# Altium project mini-et.PrjPCB
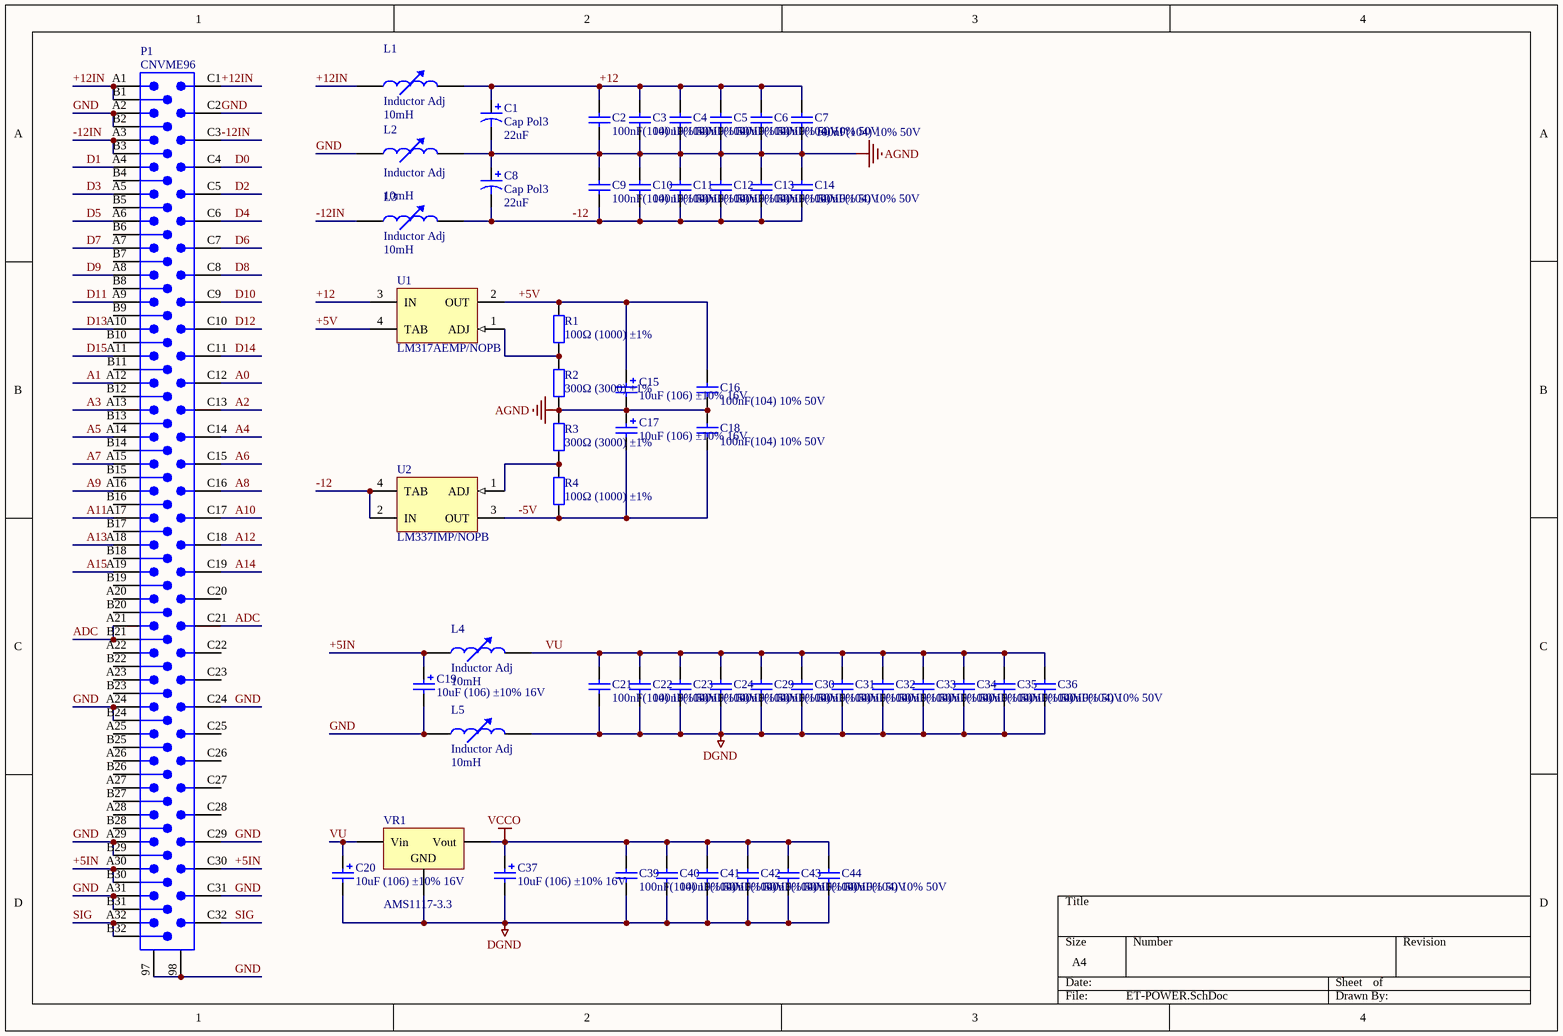
[diagram p0: ET-POWER.SchDoc]
4 sheets, 129 parts. Net scope: global (net labels, ports and power ports of the same name join across sheets).
Board file: mini-ET.PcbDoc
Sheets:
  ET-POWER.SchDoc
  ET-IO.SchDoc
  ET-AIO.SchDoc
  ET-DAC.SchDoc

## Sheet ET-POWER.SchDoc
size A4

### Parts
C1  Cap Pol3  value 22uF  [2220]
C2  100nF(104) 10% 50V  [LC-0805_C]
C3  100nF(104) 10% 50V  [LC-0805_C]
C4  100nF(104) 10% 50V  [LC-0805_C]
C5  100nF(104) 10% 50V  [LC-0805_C]
C6  100nF(104) 10% 50V  [LC-0805_C]
C7  100nF(104) 10% 50V  [LC-0805_C]
C8  Cap Pol3  value 22uF  [2220]
C9  100nF(104) 10% 50V  [LC-0805_C]
C10  100nF(104) 10% 50V  [LC-0805_C]
C11  100nF(104) 10% 50V  [LC-0805_C]
C12  100nF(104) 10% 50V  [LC-0805_C]
C13  100nF(104) 10% 50V  [LC-0805_C]
C14  100nF(104) 10% 50V  [LC-0805_C]
C15  10uF (106) ±10% 16V  [LC-CASE-A_3216]
C16  100nF(104) 10% 50V  [LC-0805_C]
C17  10uF (106) ±10% 16V  [LC-CASE-A_3216]
C18  100nF(104) 10% 50V  [LC-0805_C]
C19  10uF (106) ±10% 16V  [LC-CASE-A_3216]
C20  10uF (106) ±10% 16V  [LC-CASE-A_3216]
C21  100nF(104) 10% 50V  [LC-0805_C]
C22  100nF(104) 10% 50V  [LC-0805_C]
C23  100nF(104) 10% 50V  [LC-0805_C]
C24  100nF(104) 10% 50V  [LC-0805_C]
C29  100nF(104) 10% 50V  [LC-0805_C]
C30  100nF(104) 10% 50V  [LC-0805_C]
C31  100nF(104) 10% 50V  [LC-0805_C]
C32  100nF(104) 10% 50V  [LC-0805_C]
C33  100nF(104) 10% 50V  [LC-0805_C]
C34  100nF(104) 10% 50V  [LC-0805_C]
C35  100nF(104) 10% 50V  [LC-0805_C]
C36  100nF(104) 10% 50V  [LC-0805_C]
C37  10uF (106) ±10% 16V  [LC-CASE-A_3216]
C39  100nF(104) 10% 50V  [LC-0805_C]
C40  100nF(104) 10% 50V  [LC-0805_C]
C41  100nF(104) 10% 50V  [LC-0805_C]
C42  100nF(104) 10% 50V  [LC-0805_C]
C43  100nF(104) 10% 50V  [LC-0805_C]
C44  100nF(104) 10% 50V  [LC-0805_C]
L1  Inductor Adj  value 10mH  [AXIAL-0.4]
L2  Inductor Adj  value 10mH  [AXIAL-0.4]
L3  Inductor Adj  value 10mH  [AXIAL-0.4]
L4  Inductor Adj  value 10mH  [AXIAL-0.4]
L5  Inductor Adj  value 10mH  [AXIAL-0.4]
P1  CNVME96  [CNVME96]
R1  100Ω (1000) ±1%  [LC-0805_R]
R2  300Ω (3000) ±1%  [LC-0805_R]
R3  300Ω (3000) ±1%  [LC-0805_R]
R4  100Ω (1000) ±1%  [LC-0805_R]
U1  LM317AEMP/NOPB  [MP04A_N]
U2  LM337IMP/NOPB  [MP04A_N]
VR1  AMS1117-3.3  [LC-SOT-223]

### Nets
AGND: C1.2 C2.1 C3.1 C4.1 C5.1 C6.1 C7.1 C8.1 C9.2 C10.2 C11.2 C12.2 C13.2 C14.2 C15.2 C16.1 C17.1 C18.2 L2.2 R2.1 R3.2
DGND: C20.2 C21.1 C22.1 C23.1 C24.1 C29.1 C30.1 C31.1 C32.1 C33.1 C34.1 C35.1 C36.1 C37.2 C39.1 C40.1 C41.1 C42.1 C43.1 C44.1 L5.2 VR1.1(GND)
VCCO: C37.1 C39.2 C40.2 C41.2 C42.2 C43.2 C44.2 VR1.2(Vout)
VU: C20.1 C21.2 C22.2 C23.2 C24.2 C29.2 C30.2 C31.2 C32.2 C33.2 C34.2 C35.2 C36.2 L4.2 VR1.3(Vin)
+5IN: C19.1 L4.1 P1.A30 P1.B30 P1.C30
+5V: C15.1 C16.2 R1.2 U1.2(OUT) U1.4(TAB)
+12: C1.1 C2.2 C3.2 C4.2 C5.2 C6.2 C7.2 L1.2 U1.3(IN)
+12IN: L1.1 P1.A1 P1.B1 P1.C1
-5V: C17.2 C18.1 R4.1 U2.3(OUT)
-12: C8.2 C9.1 C10.1 C11.1 C12.1 C13.1 C14.1 L3.2 U2.2(IN) U2.4(TAB)
-12IN: L3.1 P1.A3 P1.B3 P1.C3
A0: P1.C12
A1: P1.A12
A2: P1.C13
A3: P1.A13
A4: P1.C14
A5: P1.A14
A6: P1.C15
A7: P1.A15
A8: P1.C16
A9: P1.A16
A10: P1.C17
A11: P1.A17
A12: P1.C18
A13: P1.A18
A14: P1.C19
A15: P1.A19
ADC: P1.A21 P1.B21 P1.C21
D0: P1.C4
D1: P1.A4
D2: P1.C5
D3: P1.A5
D4: P1.C6
D5: P1.A6
D6: P1.C7
D7: P1.A7
D8: P1.C8
D9: P1.A8
D10: P1.C9
D11: P1.A9
D12: P1.C10
D13: P1.A10
D14: P1.C11
D15: P1.A11
GND: C19.2 L2.1 L5.1 P1.97 P1.98 P1.A2 P1.A24 P1.A29 P1.A31 P1.B2 P1.B24 P1.B29 P1.B31 P1.C2 P1.C24 P1.C29 P1.C31
SIG: P1.A32 P1.B32 P1.C32
NetR1_1: R1.1 R2.2 U1.1(ADJ)
NetR3_1: R3.1 R4.2 U2.1(ADJ)

Not connected (* = marked no-connect by the designer): P1 A20 A22 A23 A25 A26 A27 A28 B4 B5 B6 B7 B8 B9 B10 B11 B12 B13 B14 B15 B16 B17 B18 B19 B20 B22 B23 B25 B26 B27 B28 C20 C22 C23 C25 C26 C27 C28

### Library data of the parts
C1 C8 = Cap Pol3: Polarized Capacitor (Surface Mount); Published: 8-Jun-2000; LatestRevisionDate: 29-May-2009; LatestRevisionNote: IPC-7351 Footprint Added.; PackageReference: C0805; Publisher: Altium Limited; PackageDescription: Chip Capacitor
C2-C7 C9-C14 C16 C18 C21-C24 C29-C36 C39-C44 = 0805 100nF(104) 10% 50V: 贴片电容; ComponentLink1Description: 供应商链接; ComponentLink1URL: http://www.szlcsc.com/product/details_50686.html; Package: 0805; Supplier: LC; SuppliersPartNumber: C49678
C15 C17 C19 C20 C37 = 3216 10uF (106) 10% 16V: 钽电容; ComponentLink1Description: 供应商链接; ComponentLink1URL: http://www.szlcsc.com/product/details_7643.html; Package: 3216; Supplier: LC; SuppliersPartNumber: C7171
L1-L5 = Inductor Adj: Adjustable Inductor; Set Position: 0.5; Published: 24-Mar-1999; LatestRevisionDate: 17-Jul-2002; LatestRevisionNote: Re-released for DXP Platform.; PackageReference: AXIAL-0.8; Publisher: Altium Limited; PackageDescription: Axial Device, Thru-Hole; 2 Leads; 0.8 in Pin Spacing
P1 = CNVME96: 96-Pin Connector (3x32 2.54mm grid); Text Field6: Alternate Layout Available; Text Field7: Published 14-Feb-2002
R1 R4 = 0805 100Ω (1000) 1%: 贴片电阻; ComponentLink1Description: 供应商链接; ComponentLink1URL: http://www.szlcsc.com/product/details_18096.html; Package: 0805; Supplier: LC; SuppliersPartNumber: C17408
R2 R3 = 0805 300Ω (3000) 1%: 贴片电阻; ComponentLink1Description: 供应商链接; ComponentLink1URL: http://www.szlcsc.com/product/details_18305.html; Package: 0805; Supplier: LC; SuppliersPartNumber: C17617
U1 = LM317AEMP/NOPB: 3-Terminal Adjustable Regulator, 4-pin SOT-223, Pb-Free; Manufacturer: National Semiconductor; PackageTopMarking: XYTT*N07A; PowerWise: N; CompType: LDO IC; High-Reliability: Y; DatasheetVersion: Apr-2007; PackageVersion: revB, Apr-2003; PackageReference: MP04A; PackageDescription: Molded SOT-223, 6.50 x 3.56 x 1.6mm Body, 4 Lead, 2.3mm Pitch; PartNumber: LM317AEMP/NOPB; RoHS: Y; PinCount: 4; Code_JEDEC: TO-261-AA; Code_IPC: SOT223-4; ComponentLink1Description: Manufacturer URL; ComponentLink1URL: http://www.national.com/; ComponentLink2Description: LM317 Datasheet; ComponentLink2URL: http://www.national.com/ds/LM/LM317.pdf; ComponentLink3Description: LM317 Web Page; ComponentLink3URL: http://www.national.com/pf/LM/LM317.html; ComponentLink4Description: MP04A Package Page; ComponentLink4URL: http://www.national.com/packaging/folders/mp04a.html
U2 = LM337IMP/NOPB: 3-Terminal Adjustable Negative Regulator, 4-pin SOT-223, Pb-Free; Manufacturer: National Semiconductor; PackageTopMarking: XYTT*N02A; PowerWise: N; CompType: LDO IC; Published: 1-Mar-2010; DatasheetVersion: Nov-2004; PackageVersion: revB, Apr-2003; PackageReference: MP04A; Publisher: Altium Limited; PackageDescription: Molded SOT-223, 6.50 x 3.56 x 1.6mm Body, 4 Lead, 2.3mm Pitch; Supplier 1: Digi-Key; Supplier Part Number 1: LM337IMPTR-ND; Supplier 2: Digi-Key; Supplier Part Number 2: LM337IMPCT-ND; Supplier 3: Digi-Key; Supplier Part Number 3: LM337IMPDKR-ND; Supplier 4: Newark; Supplier Part Number 4: 41K4742; PartNumber: LM337IMP/NOPB; RoHS: Y; PinCount: 4; Code_JEDEC: TO-261-AA; Code_IPC: SOT223-4; ComponentLink1Description: LM337 Datasheet; ComponentLink1URL: http://www.national.com/ds/LM/LM337.pdf; ComponentLink2Description: LM337 Web Page; ComponentLink2URL: http://www.national.com/pf/LM/LM337.html; ComponentLink3Description: MP04A Package Page; ComponentLink3URL: http://www.national.com/packaging/folders/mp04a.html
VR1 = SOT-223 AMS1117-3.3: 低压差线性稳压(LDO); ComponentLink1Description: 供应商链接; ComponentLink1URL: http://www.szlcsc.com/product/details_6652.html; Package: SOT-223; Supplier: LC; SuppliersPartNumber: C6186

## Sheet ET-IO.SchDoc
size A4
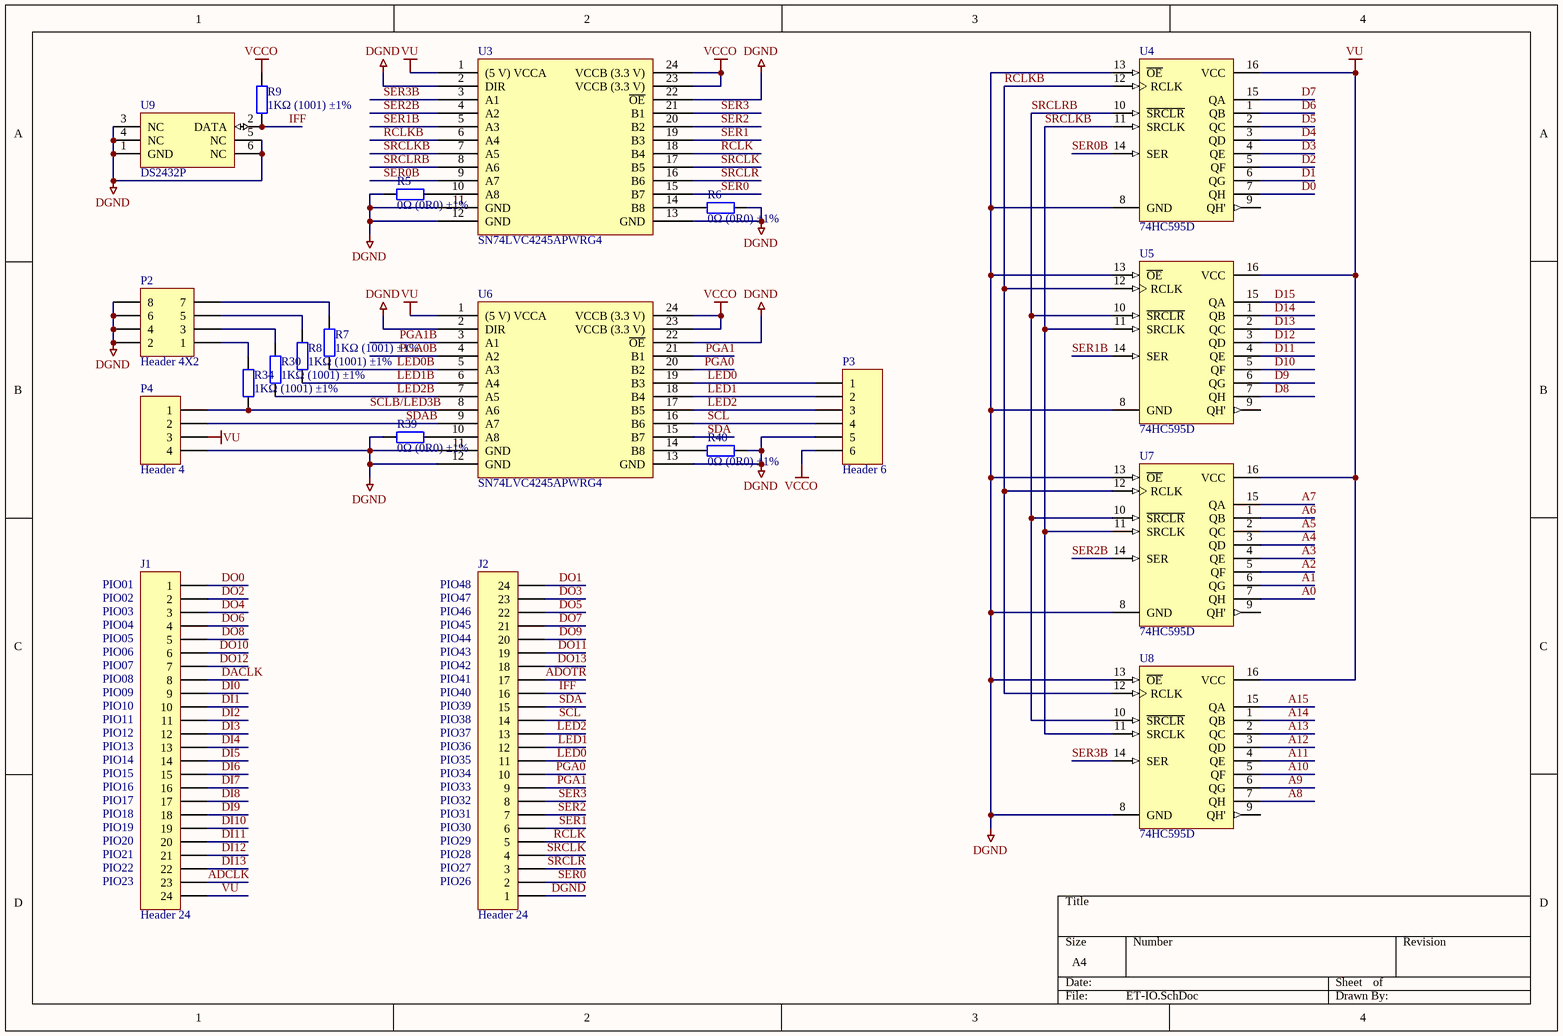
[diagram p1: ET-IO.SchDoc]

### Parts
J1  Header 24  [HDR1X24]
J2  Header 24  [HDR1X24]
P2  Header 4X2  [HDR2X4]
P3  Header 6  [HDR1X6]
P4  Header 4  [HDR1X4]
R5  0Ω (0R0) ±1%  [LC-0805_R]
R6  0Ω (0R0) ±1%  [LC-0805_R]
R7  1KΩ (1001) ±1%  [LC-0805_R]
R8  1KΩ (1001) ±1%  [LC-0805_R]
R9  1KΩ (1001) ±1%  [LC-0805_R]
R30  1KΩ (1001) ±1%  [LC-0805_R]
R34  1KΩ (1001) ±1%  [LC-0805_R]
R39  0Ω (0R0) ±1%  [LC-0805_R]
R40  0Ω (0R0) ±1%  [LC-0805_R]
U3  SN74LVC4245APWRG4  [LC-TSSOP-24]
U4  74HC595D  [LC-SOIC-16_150mil]
U5  74HC595D  [LC-SOIC-16_150mil]
U6  SN74LVC4245APWRG4  [LC-TSSOP-24]
U7  74HC595D  [LC-SOIC-16_150mil]
U8  74HC595D  [LC-SOIC-16_150mil]
U9  DS2432P  [TSOC6]

### Nets
DGND: J2.1 P2.2 P2.4 P2.6 P2.8 P3.5 P4.4 R5.1 R6.2 R39.1 R40.2 U3.2(DIR) U3.11(GND) U3.12(GND) U3.13(GND) U3.22(~{OE}) U4.8(GND) U4.13(~{OE}) U5.8(GND) U5.13(~{OE}) U6.2(DIR) U6.11(GND) U6.12(GND) U6.13(GND) U6.22(~{OE}) U7.8(GND) U7.13(~{OE}) U8.8(GND) U8.13(~{OE}) U9.1(GND) U9.3(NC) U9.4(NC) U9.5(NC) U9.6(NC)
VCCO: P3.6 R9.1 U3.23(VCCB_(3.3_V)) U3.24(VCCB_(3.3_V)) U6.23(VCCB_(3.3_V)) U6.24(VCCB_(3.3_V))
VU: J1.24 P4.3 U3.1((5_V)_VCCA) U4.16(VCC) U5.16(VCC) U6.1((5_V)_VCCA) U7.16(VCC) U8.16(VCC)
A0: U7.7(QH)
A1: U7.6(QG)
A2: U7.5(QF)
A3: U7.4(QE)
A4: U7.3(QD)
A5: U7.2(QC)
A6: U7.1(QB)
A7: U7.15(QA)
A8: U8.7(QH)
A9: U8.6(QG)
A10: U8.5(QF)
A11: U8.4(QE)
A12: U8.3(QD)
A13: U8.2(QC)
A14: U8.1(QB)
A15: U8.15(QA)
ADCLK: J1.23
ADOTR: J2.17
D0: U4.7(QH)
D1: U4.6(QG)
D2: U4.5(QF)
D3: U4.4(QE)
D4: U4.3(QD)
D5: U4.2(QC)
D6: U4.1(QB)
D7: U4.15(QA)
D8: U5.7(QH)
D9: U5.6(QG)
D10: U5.5(QF)
D11: U5.4(QE)
D12: U5.3(QD)
D13: U5.2(QC)
D14: U5.1(QB)
D15: U5.15(QA)
DACLK: J1.8
DI0: J1.9
DI1: J1.10
DI2: J1.11
DI3: J1.12
DI4: J1.13
DI5: J1.14
DI6: J1.15
DI7: J1.16
DI8: J1.17
DI9: J1.18
DI10: J1.19
DI11: J1.20
DI12: J1.21
DI13: J1.22
DO0: J1.1
DO1: J2.24
DO2: J1.2
DO3: J2.23
DO4: J1.3
DO5: J2.22
DO6: J1.4
DO7: J2.21
DO8: J1.5
DO9: J2.20
DO10: J1.6
DO11: J2.19
DO12: J1.7
DO13: J2.18
IFF: J2.16 R9.2 U9.2(DATA)
LED0: J2.11 P3.1 U6.19(B3)
LED0B: R7.2 U6.5(A3)
LED1: J2.12 P3.2 U6.18(B4)
LED1B: R8.2 U6.6(A4)
LED2: J2.13 P3.3 U6.17(B5)
LED2B: R30.1 U6.7(A5)
PGA0: J2.10 U6.20(B2)
PGA0B: U6.4(A2)
PGA1: J2.9 U6.21(B1)
PGA1B: U6.3(A1)
RCLK: J2.5 U3.18(B4)
RCLKB: U3.6(A4) U4.12(RCLK) U5.12(RCLK) U7.12(RCLK) U8.12(RCLK)
SCL: J2.14 P3.4 U6.16(B6)
SCLB/LED3B: P4.1 R34.2 U6.8(A6)
SDA: J2.15 U6.15(B7)
SDAB: P4.2 U6.9(A7)
SER0: J2.2 U3.15(B7)
SER0B: U3.9(A7) U4.14(SER)
SER1: J2.6 U3.19(B3)
SER1B: U3.5(A3) U5.14(SER)
SER2: J2.7 U3.20(B2)
SER2B: U3.4(A2) U7.14(SER)
SER3: J2.8 U3.21(B1)
SER3B: U3.3(A1) U8.14(SER)
SRCLK: J2.4 U3.17(B5)
SRCLKB: U3.7(A5) U4.11(SRCLK) U5.11(SRCLK) U7.11(SRCLK) U8.11(SRCLK)
SRCLR: J2.3 U3.16(B6)
SRCLRB: U3.8(A6) U4.10(~{SRCLR}) U5.10(~{SRCLR}) U7.10(~{SRCLR}) U8.10(~{SRCLR})
NetP2_1: P2.1 R34.1
NetP2_3: P2.3 R30.2
NetP2_5: P2.5 R8.1
NetP2_7: P2.7 R7.1
NetR5_2: R5.2 U3.10(A8)
NetR6_1: R6.1 U3.14(B8)
NetR39_2: R39.2 U6.10(A8)
NetR40_1: R40.1 U6.14(B8)

Not connected (* = marked no-connect by the designer): U4 9(QH'); U5 9(QH'); U7 9(QH'); U8 9(QH')

### Notes on the sheet
- (near J1) PIO01
- (near J1) PIO02
- (near J1) PIO03
- (near J1) PIO04
- (near J1) PIO05
- (near J1) PIO06
- (near J2) PIO48
- (near J2) PIO47
- (near J2) PIO46
- (near J2) PIO45
- (near J2) PIO44
- (near J2) PIO43
- (near J1) PIO07
- (near J1) PIO08
- (near J1) PIO09
- (near J1) PIO10
- (near J2) PIO42
- (near J2) PIO41
- (near J2) PIO40
- (near J2) PIO39
- (near J1) PIO11
- (near J1) PIO12
- (near J1) PIO13
- (near J1) PIO14
- (near J1) PIO15
- (near J1) PIO16
- (near J2) PIO38
- (near J2) PIO37
- (near J2) PIO36
- (near J2) PIO35
- (near J2) PIO34
- (near J2) PIO33
- (near J1) PIO17
- (near J1) PIO18
- (near J1) PIO19
- (near J1) PIO20
- (near J2) PIO32
- (near J2) PIO31
- (near J2) PIO30
- (near J2) PIO29
- (near J1) PIO21
- (near J1) PIO22
- (near J1) PIO23
- (near J2) PIO28
- (near J2) PIO27
- (near J2) PIO26

### Library data of the parts
J1 J2 = Header 24: Header, 24-Pin; LatestRevisionDate: 17-Jul-2002; LatestRevisionNote: Re-released for DXP Platform.; Publisher: Altium Limited
P2 = Header 4X2: Header, 4-Pin, Dual row; LatestRevisionDate: 17-Jul-2002; LatestRevisionNote: Re-released for DXP Platform.; Publisher: Altium Limited
P3 = Header 6: Header, 6-Pin; LatestRevisionDate: 17-Jul-2002; LatestRevisionNote: Re-released for DXP Platform.; Publisher: Altium Limited
P4 = Header 4: Header, 4-Pin; LatestRevisionDate: 17-Jul-2002; LatestRevisionNote: Re-released for DXP Platform.; Publisher: Altium Limited
R5 R6 R39 R40 = 0805 0Ω (0R0) 1%: 贴片电阻; ComponentLink1Description: 供应商链接; ComponentLink1URL: http://www.szlcsc.com/product/details_18165.html; Package: 0805; Supplier: LC; SuppliersPartNumber: C17477
R7-R9 R30 R34 = 0805 1KΩ (1001) 1%: 贴片电阻; ComponentLink1Description: 供应商链接; ComponentLink1URL: http://www.szlcsc.com/product/details_18201.html; Package: 0805; Supplier: LC; SuppliersPartNumber: C17513
U3 U6 = SN74LVC4245APWRG4: 74系列逻辑芯片; ComponentLink1Description: 供应商链接; ComponentLink1URL: http://www.szlcsc.com/product/details_8336.html; Package: TSSOP-24; Supplier: LC; SuppliersPartNumber: C7859
U4 U5 U7 U8 = 74HC595D: 74系列逻辑芯片; ComponentLink1Description: 供应商链接; ComponentLink1URL: http://www.szlcsc.com/product/details_6413.html; Package: SOIC-16_150mil; Supplier: LC; SuppliersPartNumber: C5947
U9 = DS2430AP: 256-Bit 1-Wire EEPROM; Note: Pin numbers 3-6 are Not Connected (NC); Published: 13-Oct-2000; LatestRevisionDate: 17-Jul-2002; LatestRevisionNote: Re-released for DXP Platform.; DatasheetVersion: 21-Oct-1999; PackageVersion: 1999; PackageReference: TSOC6; Publisher: Altium Limited; PackageDescription: Small Outline; 6 C-Bend Leads; Body Width 3.8 mm; Pitch 1.27 mm; ComponentLink1Description: Manufacturer Link; ComponentLink1URL: http://www.maxim-ic.com/; ComponentLink2Description: Datasheet; ComponentLink2URL: http://pdfserv.maxim-ic.com/en/ds/DS2430A.pdf

## Sheet ET-AIO.SchDoc: Eurocard VME 3U (3.937 x 6.299 inches)
size A4; Organization: Organization; Address1: Address1; Address2: Address2; Address3: Address3; Address4: Address4; DocumentNumber: 1; Revision: 0; SheetNumber: 2; SheetTotal: 2
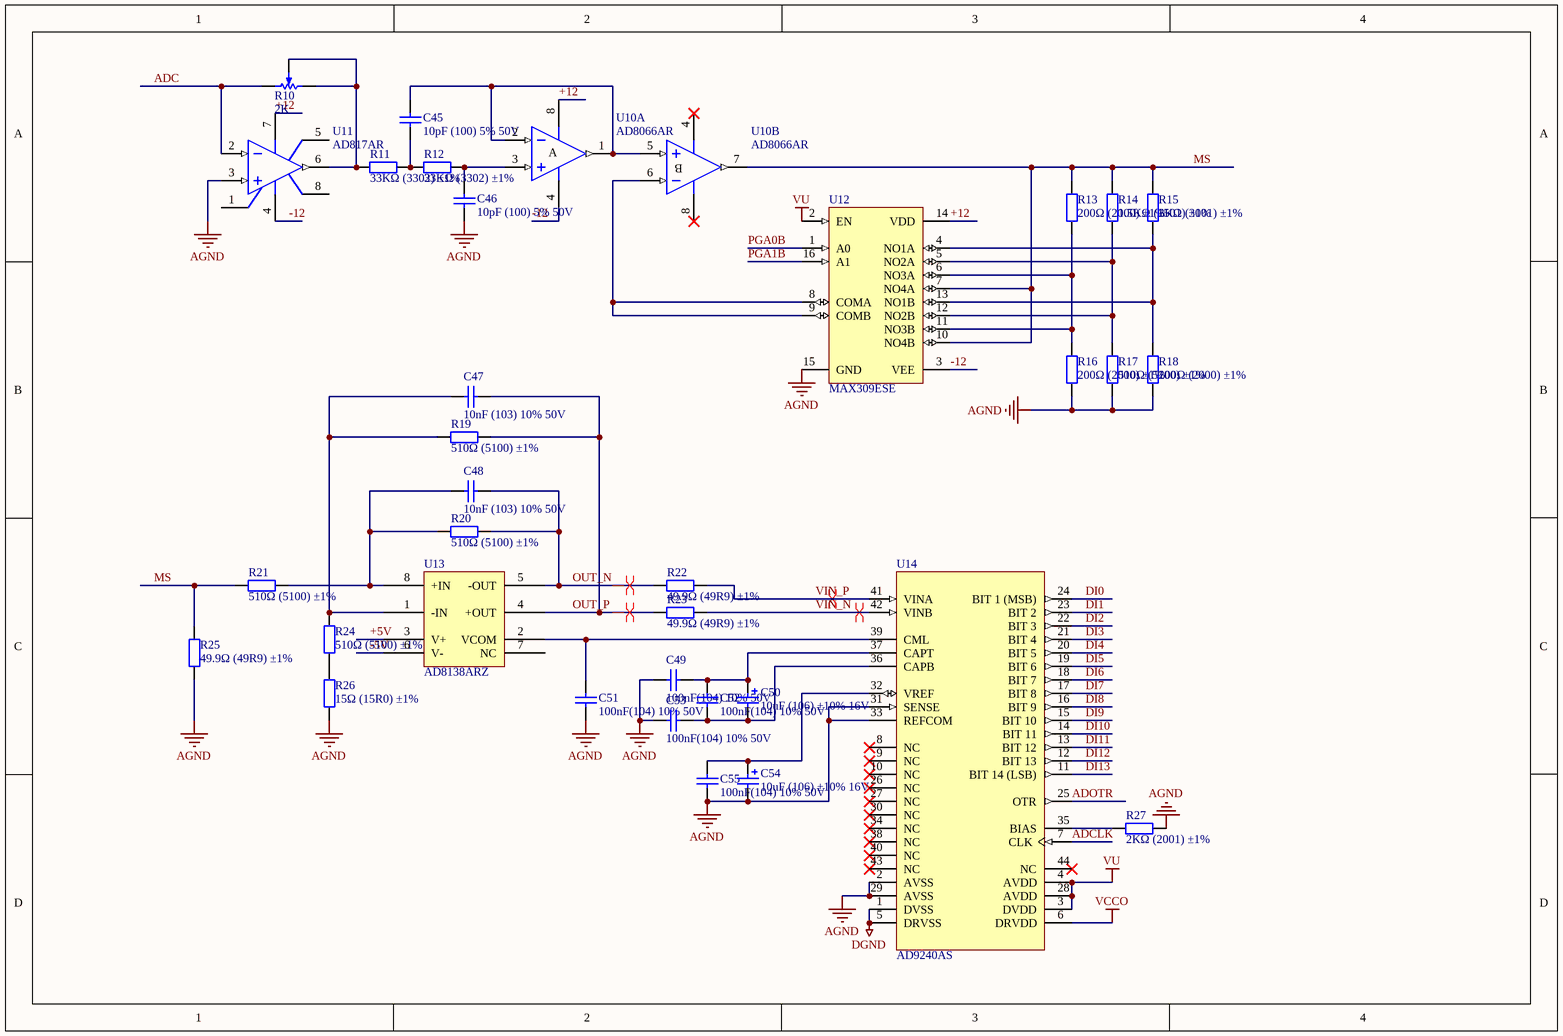
[diagram p2: ET-AIO.SchDoc]

### Parts
C45  10pF (100) 5% 50V  [LC-0805_C]
C46  10pF (100) 5% 50V  [LC-0805_C]
C47  10nF (103) 10% 50V  [LC-0805_C]
C48  10nF (103) 10% 50V  [LC-0805_C]
C49  100nF(104) 10% 50V  [LC-0805_C]
C50  10uF (106) ±10% 16V  [LC-CASE-A_3216]
C51  100nF(104) 10% 50V  [LC-0805_C]
C52  100nF(104) 10% 50V  [LC-0805_C]
C53  100nF(104) 10% 50V  [LC-0805_C]
C54  10uF (106) ±10% 16V  [LC-CASE-A_3216]
C55  100nF(104) 10% 50V  [LC-0805_C]
R10  2K  [POT4MM-2]
R11  33KΩ (3302) ±1%  [LC-0805_R]
R12  33KΩ (3302) ±1%  [LC-0805_R]
R13  200Ω (2000) ±1%  [LC-0805_R]
R14  1.5KΩ (1501) ±1%  [LC-0805_R]
R15  3KΩ (3001) ±1%  [LC-0805_R]
R16  200Ω (2000) ±1%  [LC-0805_R]
R17  510Ω (5100) ±1%  [LC-0805_R]
R18  200Ω (2000) ±1%  [LC-0805_R]
R19  510Ω (5100) ±1%  [LC-0805_R]
R20  510Ω (5100) ±1%  [LC-0805_R]
R21  510Ω (5100) ±1%  [LC-0805_R]
R22  49.9Ω (49R9) ±1%  [LC-0805_R]
R23  49.9Ω (49R9) ±1%  [LC-0805_R]
R24  510Ω (5100) ±1%  [LC-0805_R]
R25  49.9Ω (49R9) ±1%  [LC-0805_R]
R26  15Ω (15R0) ±1%  [LC-0805_R]
R27  2KΩ (2001) ±1%  [LC-0805_R]
U10  AD8066AR  [SO-8_N]  (parts A,B of 2)
U11  AD817AR  [SO-8_N]
U12  MAX309ESE  [NSO16_N]
U13  AD8138ARZ  [SO-8_N]
U14  AD9240AS  [S-44-MQFP_N]

### Nets
AGND: C46.1 C49.2 C51.1 C53.2 C54.2 C55.1 R16.1 R17.1 R18.1 R25.1 R26.1 R27.2 U11.3(IN+) U12.15(GND) U14.2(AVSS) U14.29(AVSS) U14.31(SENSE) U14.33(REFCOM)
DGND: U14.1(DVSS) U14.5(DRVSS)
VCCO: U14.6(DRVDD)
VU: U12.2(EN) U14.3(DVDD) U14.4(AVDD) U14.28(AVDD)
+5V: U13.3(V+)
+12: U10.8(V+) U11.7(V+) U12.14(VDD)
-5V: U13.6(V-)
-12: U10.4(V-) U11.4(V-) U12.3(VEE)
ADC: R10.CW(+) U11.2(IN-)
ADCLK: U14.7(CLK)
ADOTR: U14.25(OTR)
DI0: U14.24(BIT_1_(MSB))
DI1: U14.23(BIT_2)
DI2: U14.22(BIT_3)
DI3: U14.21(BIT_4)
DI4: U14.20(BIT_5)
DI5: U14.19(BIT_6)
DI6: U14.18(BIT_7)
DI7: U14.17(BIT_8)
DI8: U14.16(BIT_9)
DI9: U14.15(BIT_10)
DI10: U14.14(BIT_11)
DI11: U14.13(BIT_12)
DI12: U14.12(BIT_13)
DI13: U14.11(BIT_14_(LSB))
MS: R13.2 R14.2 R15.2 R21.1 R25.2 U10.7(OUT) U12.7(NO4A) U12.10(NO4B)
OUT_N: C48.2 R20.2 R22.1 U13.5(-OUT)
OUT_P: C47.2 R19.2 R23.1 U13.4(+OUT)
PGA0B: U12.1(A0)
PGA1B: U12.16(A1)
VIN_N: R23.2 U14.42(VINB)
VIN_P: R22.2 U14.41(VINA)
NetC45_1: C45.1 R11.2 R12.1
NetC45_2: C45.2 U10.1(OUT) U10.2(IN-) U10.5(IN+)
NetC46_2: C46.2 R12.2 U10.3(IN+)
NetC47_1: C47.1 R19.1 R24.2 U13.1(-IN)
NetC48_1: C48.1 R20.1 R21.2 U13.8(+IN)
NetC49_1: C49.1 C50.1 C52.2 U14.37(CAPT)
NetC50_2: C50.2 C52.1 C53.1 U14.36(CAPB)
NetC51_2: C51.2 U13.2(VCOM) U14.39(CML)
NetC54_1: C54.1 C55.2 U14.32(VREF)
NetR10_CCW: R10.CCW(-) R10.W R11.1 U11.6(OUT)
NetR13_1: R13.1 R16.2 U12.6(NO3A) U12.11(NO3B)
NetR14_1: R14.1 R17.2 U12.5(NO2A) U12.12(NO2B)
NetR15_1: R15.1 R18.2 U12.4(NO1A) U12.13(NO1B)
NetR24_1: R24.1 R26.2
NetR27_1: R27.1 U14.35(BIAS)
NetU10_6: U10.6(IN-) U12.8(COMA) U12.9(COMB)

Not connected (* = marked no-connect by the designer): U11 1(NULL1) 5(NC) 8(NULL2); U13 7(NC); U14 8(NC)* 9(NC)* 10(NC)* 26(NC)* 27(NC)* 30(NC)* 34(NC)* 38(NC)* 40(NC)* 43(NC)* 44(NC)*

### Layout directives
differential pair: OUT_N, OUT_P, VIN_N, VIN_P

### Notes on the sheet
- (in symbol AD8056AR, part A) A
- (in symbol AD8056AR, part B) B

### Library data of the parts
C45 C46 = 0805 10pF (100) 5% 50V: 贴片电容; ComponentLink1Description: 供应商链接; ComponentLink1URL: http://www.szlcsc.com/product/details_2137.html; Package: 0805; Supplier: LC; SuppliersPartNumber: C1785
C47 C48 = 0805 10nF (103) 10% 50V: 贴片电容; ComponentLink1Description: 供应商链接; ComponentLink1URL: http://www.szlcsc.com/product/details_2062.html; Package: 0805; Supplier: LC; SuppliersPartNumber: C1710
C49 C51-C53 C55 = 0805 100nF(104) 10% 50V: 贴片电容; ComponentLink1Description: 供应商链接; ComponentLink1URL: http://www.szlcsc.com/product/details_50686.html; Package: 0805; Supplier: LC; SuppliersPartNumber: C49678
C50 C54 = 3216 10uF (106) 10% 16V: 钽电容; ComponentLink1Description: 供应商链接; ComponentLink1URL: http://www.szlcsc.com/product/details_7643.html; Package: 3216; Supplier: LC; SuppliersPartNumber: C7171
R10 = RPot SM: Square Trimming Potentiometer; Published: 17-Dec-2003; DatasheetVersion: Oct-2003; PackageReference: POT4MM-2; Publisher: Altium Limited; PackageDescription: Square Trimming Potentiometer; ComponentLink1Description: Manufacturer Link; ComponentLink1URL: http://bourns.com/2/search.html
R11 R12 = 0805 33KΩ (3302) 1%: 贴片电阻; ComponentLink1Description: 供应商链接; ComponentLink1URL: http://www.szlcsc.com/product/details_18321.html; Package: 0805; Supplier: LC; SuppliersPartNumber: C17633
R13 R16 R18 = 0805 200Ω (2000) 1%: 贴片电阻; ComponentLink1Description: 供应商链接; ComponentLink1URL: http://www.szlcsc.com/product/details_18228.html; Package: 0805; Supplier: LC; SuppliersPartNumber: C17540
R14 = 0805 1.5KΩ (1501) 1%: 贴片电阻; ComponentLink1Description: 供应商链接; ComponentLink1URL: http://www.szlcsc.com/product/details_4717.html; Package: 0805; Supplier: LC; SuppliersPartNumber: C4310
R15 = 0805 3KΩ (3001) 1%: 贴片电阻; ComponentLink1Description: 供应商链接; ComponentLink1URL: http://www.szlcsc.com/product/details_18349.html; Package: 0805; Supplier: LC; SuppliersPartNumber: C17661
R17 R19-R21 R24 = 0805 510Ω (5100) 1%: 贴片电阻; ComponentLink1Description: 供应商链接; ComponentLink1URL: http://www.szlcsc.com/product/details_18422.html; Package: 0805; Supplier: LC; SuppliersPartNumber: C17734
R22 R23 R25 = 0805 49.9Ω (49R9) 1%: 贴片电阻; ComponentLink1Description: 供应商链接; ComponentLink1URL: http://www.szlcsc.com/product/details_18408.html; Package: 0805; Supplier: LC; SuppliersPartNumber: C17720
R26 = 0805 15Ω (15R0) 1%: 贴片电阻; ComponentLink1Description: 供应商链接; ComponentLink1URL: http://www.szlcsc.com/product/details_18168.html; Package: 0805; Supplier: LC; SuppliersPartNumber: C17480
R27 = 0805 2KΩ (2001) 1%: 贴片电阻; ComponentLink1Description: 供应商链接; ComponentLink1URL: http://www.szlcsc.com/product/details_18292.html; Package: 0805; Supplier: LC; SuppliersPartNumber: C17604
U10 = AD8056AR: Low Cost, 300MHz Voltage Feedback Amplifier; Published: 8-Jun-2000; LatestRevisionDate: 13-Apr-2006; LatestRevisionNote: IPC-7351 Footprint Added.; DatasheetVersion: REV. 0 1997; PackageVersion: revA; PackageReference: SO-8; Publisher: Altium Limited; PackageDescription: 8-Pin Small Outline Integrated Circuit 1.27 mm Pitch; Code_JEDEC: MS-012-AA; Code_IPC: SOIC127P600-8; ComponentLink1Description: Manufacturer Link; ComponentLink1URL: http://www.analog.com/en/prod/0,,759_786_AD8055%2C00.html; ComponentLink2Description: Datasheet; ComponentLink2URL: http://www.analog.com/UploadedFiles/Data_Sheets/40402558757264AD8055_6_i.pdf
U11 = AD817AR: High-Speed, Low-Power Wide Supply Range Amplifier; Note: Pin 5 is not connected.; Published: 8-Jun-2000; LatestRevisionDate: 13-Apr-2006; LatestRevisionNote: IPC-7351 Footprint Added.; DatasheetVersion: REV. B 1995; PackageVersion: revA; PackageReference: SO-8; Publisher: Altium Limited; PackageDescription: 8-Pin Small Outline Integrated Circuit 1.27 mm Pitch; Code_JEDEC: MS-012-AA; Code_IPC: SOIC127P600-8; ComponentLink1Description: Manufacturer Link; ComponentLink1URL: http://www.analog.com/en/prod/0,,759_786_AD817%2C00.html; ComponentLink2Description: Datasheet; ComponentLink2URL: http://www.analog.com/UploadedFiles/Data_Sheets/289066266ad817.pdf
U12 = MAX309ESE: Precision, Dual 4-Channel, High-Performance, CMOS Analog Multiplexer; Published: 16-Jan-2001; LatestRevisionDate: 13-Apr-2006; LatestRevisionNote: IPC-7351 Footprint Added.; DatasheetVersion: Jul-1994; PackageReference: NSO16; Publisher: Altium Limited; PackageDescription: 16-Pin Small Outline Integrated Circuit 1.27 mm Pitch; Code_JEDEC: MS-012-AC; Code_IPC: SOIC127P600-16; ComponentLink1Description: Manufacturer Link; ComponentLink1URL: http://www.maxim-ic.com/; ComponentLink2Description: Datasheet; ComponentLink2URL: http://pdfserv.maxim-ic.com/en/ds/MAX308-MAX309.pdf
U14 = AD9240AS: Complete 14-Bit, 10 MSPS Monolithic A/D Converter, 44-Pin MQFP, Industrial; Published: 26-May-2004; LatestRevisionDate: 13-Apr-2006; LatestRevisionNote: IPC-7351 Footprint Added.; DatasheetVersion: Rev. A; PackageVersion: Rev. A; PackageReference: S-44-MQFP; Publisher: Altium Limited; PackageDescription: 44-Pin Metric Quad Flat Pack 0.8 mm Pitch; Code_IPC: QFP80P1320X1320-44; ComponentLink1Description: Manufacturer Link; ComponentLink1URL: http://www.analog.com/en/prod/0%2C2877%2CAD9240%2C00.html; ComponentLink2Description: Datasheet; ComponentLink2URL: http://www.analog.com/UploadedFiles/Data_Sheets/417954540AD9240_a.pdf

## Sheet ET-DAC.SchDoc
size A4
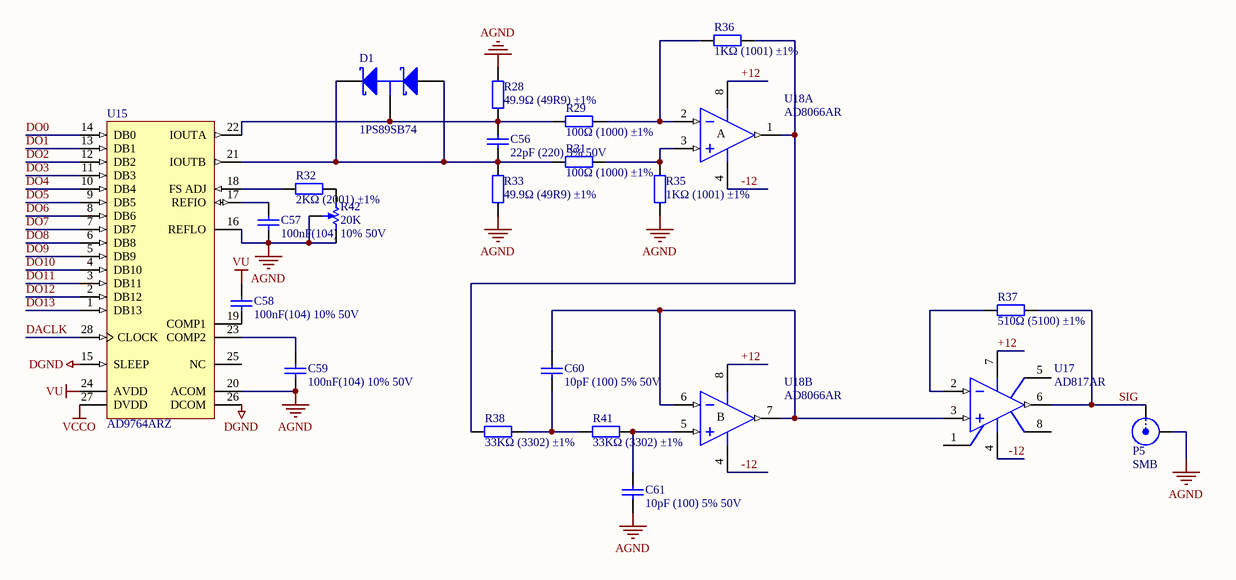
[diagram p3: ET-DAC.SchDoc]

### Parts
C56  22pF (220) 5% 50V  [LC-0805_C]
C57  100nF(104) 10% 50V  [LC-0805_C]
C58  100nF(104) 10% 50V  [LC-0805_C]
C59  100nF(104) 10% 50V  [LC-0805_C]
C60  10pF (100) 5% 50V  [LC-0805_C]
C61  10pF (100) 5% 50V  [LC-0805_C]
D1  1PS89SB74  [SOT23_M]
P5  SMB  [SMB_V-RJ45]
R28  49.9Ω (49R9) ±1%  [LC-0805_R]
R29  100Ω (1000) ±1%  [LC-0805_R]
R31  100Ω (1000) ±1%  [LC-0805_R]
R32  2KΩ (2001) ±1%  [LC-0805_R]
R33  49.9Ω (49R9) ±1%  [LC-0805_R]
R35  1KΩ (1001) ±1%  [LC-0805_R]
R36  1KΩ (1001) ±1%  [LC-0805_R]
R37  510Ω (5100) ±1%  [LC-0805_R]
R38  33KΩ (3302) ±1%  [LC-0805_R]
R41  33KΩ (3302) ±1%  [LC-0805_R]
R42  20K  [POT4MM-2]
U15  AD9764ARZ  [RW-28_N]
U17  AD817AR  [SO-8_N]
U18  AD8066AR  [SO-8_N]  (parts A,B of 2)

### Nets
AGND: C57.1 C59.1 C61.1 P5.2(Y) R28.2 R33.1 R35.2 R42.CW(+) R42.W U15.16(REFLO) U15.20(ACOM)
DGND: U15.15(SLEEP) U15.26(DCOM)
VCCO: U15.27(DVDD)
VU: C58.2 U15.24(AVDD)
+12: U17.7(V+) U18.8(V+)
-12: U17.4(V-) U18.4(V-)
DACLK: U15.28(CLOCK)
DO0: U15.14(DB0)
DO1: U15.13(DB1)
DO2: U15.12(DB2)
DO3: U15.11(DB3)
DO4: U15.10(DB4)
DO5: U15.9(DB5)
DO6: U15.8(DB6)
DO7: U15.7(DB7)
DO8: U15.6(DB8)
DO9: U15.5(DB9)
DO10: U15.4(DB10)
DO11: U15.3(DB11)
DO12: U15.2(DB12)
DO13: U15.1(DB13)
SIG: P5.1(X) R37.2 U17.6(OUT)
NetC56_1: C56.1 D1.1(A) D1.2(K) R31.1 R33.2 U15.21(IOUTB)
NetC56_2: C56.2 D1.3(C) R28.1 R29.1 U15.22(IOUTA)
NetC57_2: C57.2 U15.17(REFIO)
NetC58_1: C58.1 U15.19(COMP1)
NetC59_2: C59.2 U15.23(COMP2)
NetC60_1: C60.1 R38.2 R41.1
NetC60_2: C60.2 U17.3(IN+) U18.6(IN-) U18.7(OUT)
NetC61_2: C61.2 R41.2 U18.5(IN+)
NetR29_2: R29.2 R36.2 U18.2(IN-)
NetR31_2: R31.2 R35.1 U18.3(IN+)
NetR32_1: R32.1 R42.CCW(-)
NetR32_2: R32.2 U15.18(FS_ADJ)
NetR36_1: R36.1 R38.1 U18.1(OUT)
NetR37_1: R37.1 U17.2(IN-)

Not connected (* = marked no-connect by the designer): U15 25(NC); U17 1(NULL1) 5(NC) 8(NULL2)

### Notes on the sheet
- (in symbol AD8056AR, part A) A
- (in symbol AD8056AR, part B) B

### Library data of the parts
C56 = 0805 22pF (220) 5% 50V: 贴片电容; ComponentLink1Description: 供应商链接; ComponentLink1URL: http://www.szlcsc.com/product/details_2156.html; Package: 0805; Supplier: LC; SuppliersPartNumber: C1804
C57-C59 = 0805 100nF(104) 10% 50V: 贴片电容; ComponentLink1Description: 供应商链接; ComponentLink1URL: http://www.szlcsc.com/product/details_50686.html; Package: 0805; Supplier: LC; SuppliersPartNumber: C49678
C60 C61 = 0805 10pF (100) 5% 50V: 贴片电容; ComponentLink1Description: 供应商链接; ComponentLink1URL: http://www.szlcsc.com/product/details_2137.html; Package: 0805; Supplier: LC; SuppliersPartNumber: C1785
D1 = 1PS89SB74: Schottky Barrier Double Diode; Published: 17-Sep-2003; DatasheetVersion: 20-Apr-2001; PackageVersion: Oct-1998; PackageReference: SOT490; Publisher: Altium Limited; PackageDescription: SC-89; 3 Flat Leads; Body 1.6 x 1.6 x 0.7 mm, inc leads (LxWxH typ); ComponentLink1Description: Manufacturer Link; ComponentLink1URL: http://www.semiconductors.philips.com/; ComponentLink2Description: Datasheet; ComponentLink2URL: http://www.semiconductors.philips.com/acrobat/datasheets/1PS89SB74_1.pdf
P5 = SMB: SMB Straight Connector; LatestRevisionDate: 17-Jul-2002; LatestRevisionNote: Re-released for DXP Platform.; Publisher: Altium Limited
R28 R33 = 0805 49.9Ω (49R9) 1%: 贴片电阻; ComponentLink1Description: 供应商链接; ComponentLink1URL: http://www.szlcsc.com/product/details_18408.html; Package: 0805; Supplier: LC; SuppliersPartNumber: C17720
R29 R31 = 0805 100Ω (1000) 1%: 贴片电阻; ComponentLink1Description: 供应商链接; ComponentLink1URL: http://www.szlcsc.com/product/details_18096.html; Package: 0805; Supplier: LC; SuppliersPartNumber: C17408
R32 = 0805 2KΩ (2001) 1%: 贴片电阻; ComponentLink1Description: 供应商链接; ComponentLink1URL: http://www.szlcsc.com/product/details_18292.html; Package: 0805; Supplier: LC; SuppliersPartNumber: C17604
R35 R36 = 0805 1KΩ (1001) 1%: 贴片电阻; ComponentLink1Description: 供应商链接; ComponentLink1URL: http://www.szlcsc.com/product/details_18201.html; Package: 0805; Supplier: LC; SuppliersPartNumber: C17513
R37 = 0805 510Ω (5100) 1%: 贴片电阻; ComponentLink1Description: 供应商链接; ComponentLink1URL: http://www.szlcsc.com/product/details_18422.html; Package: 0805; Supplier: LC; SuppliersPartNumber: C17734
R38 R41 = 0805 33KΩ (3302) 1%: 贴片电阻; ComponentLink1Description: 供应商链接; ComponentLink1URL: http://www.szlcsc.com/product/details_18321.html; Package: 0805; Supplier: LC; SuppliersPartNumber: C17633
R42 = RPot SM: Square Trimming Potentiometer; Published: 17-Dec-2003; DatasheetVersion: Oct-2003; PackageReference: POT4MM-2; Publisher: Altium Limited; PackageDescription: Square Trimming Potentiometer; ComponentLink1Description: Manufacturer Link; ComponentLink1URL: http://bourns.com/2/search.html
U15 = AD9764ARZ: Single 14-Bit TxDAC, 125 Msps, -40 to +85 degC, RW-28, Pb-Free, Tube; Generic Part Number: AD9764; Manufacturer: Analog Devices; # DAC Outputs: 1; Max V+: 5.5V; Op Pwr Diss: 170mW; Resolution (Bits): 14; Settling Time: 35ns; Single Supply: Yes; DatasheetVersion: Rev.B; PackageVersion: 060706-A; PackageReference: RW-28; PackageDescription: 28-Lead Standard Small Outline Package [SOIC_W]; Supplier 1: Digi-Key; Supplier Part Number 1: AD9764ARZ-ND; Supplier 2: Farnell; Supplier Part Number 2: 9425640; Supplier 3: Newark; Supplier Part Number 3: 59K7408; Supplier 4: Mouser; Supplier Part Number 4: 584-AD9764ARZ; Packing: Tube; RoHS: Y; Mounting Technology: Surface Mount; Code_JEDEC: MS-013-AE; PartNumber: AD9764ARZ; ComponentLink1Description: Manufacturer URL; ComponentLink1URL: http://www.analog.com/en/index.html; ComponentLink2Description: Datasheet; ComponentLink2URL: http://www.analog.com/static/imported-files/data_sheets/AD9764.pdf; ComponentLink3Description: Product URL; ComponentLink3URL: http://www.analog.com/en/digital-to-analog-converters/da-converters/ad9764/products/product.html
U17 = AD817AR: as U11 on sheet ET-AIO; Published: 8-Jun-2000; LatestRevisionDate: 13-Apr-2006; LatestRevisionNote: IPC-7351 Footprint Added.; DatasheetVersion: REV. B 1995; PackageVersion: revA; PackageReference: SO-8; Publisher: Altium Limited; PackageDescription: 8-Pin Small Outline Integrated Circuit 1.27 mm Pitch; Code_JEDEC: MS-012-AA; Code_IPC: SOIC127P600-8; ComponentLink1Description: Manufacturer Link; ComponentLink1URL: http://www.analog.com/en/prod/0,,759_786_AD817%2C00.html; ComponentLink2Description: Datasheet; ComponentLink2URL: http://www.analog.com/UploadedFiles/Data_Sheets/289066266ad817.pdf
U18 = AD8056AR: as U10 on sheet ET-AIO; Published: 8-Jun-2000; LatestRevisionDate: 13-Apr-2006; LatestRevisionNote: IPC-7351 Footprint Added.; DatasheetVersion: REV. 0 1997; PackageVersion: revA; PackageReference: SO-8; Publisher: Altium Limited; PackageDescription: 8-Pin Small Outline Integrated Circuit 1.27 mm Pitch; Code_JEDEC: MS-012-AA; Code_IPC: SOIC127P600-8; ComponentLink1Description: Manufacturer Link; ComponentLink1URL: http://www.analog.com/en/prod/0,,759_786_AD8055%2C00.html; ComponentLink2Description: Datasheet; ComponentLink2URL: http://www.analog.com/UploadedFiles/Data_Sheets/40402558757264AD8055_6_i.pdf

## Nets that join several sheets
AGND: ET-POWER (21 pins), ET-AIO (18 pins), ET-DAC (11 pins)
DGND: ET-POWER (22 pins), ET-IO (34 pins), ET-AIO (U14.1 U14.5), ET-DAC (U15.15 U15.26)
VCCO: ET-POWER (8 pins), ET-IO (6 pins), ET-AIO (U14.6), ET-DAC (U15.27)
VU: ET-POWER (15 pins), ET-IO (8 pins), ET-AIO (U12.2 U14.3 U14.4 U14.28), ET-DAC (C58.2 U15.24)
+5V: ET-POWER (5 pins), ET-AIO (U13.3)
+12: ET-POWER (9 pins), ET-AIO (U10.8 U11.7 U12.14), ET-DAC (U17.7 U18.8)
-5V: ET-POWER (C17.2 C18.1 R4.1 U2.3), ET-AIO (U13.6)
-12: ET-POWER (10 pins), ET-AIO (U10.4 U11.4 U12.3), ET-DAC (U17.4 U18.4)
A0: ET-POWER (P1.C12), ET-IO (U7.7)
A1: ET-POWER (P1.A12), ET-IO (U7.6)
A2: ET-POWER (P1.C13), ET-IO (U7.5)
A3: ET-POWER (P1.A13), ET-IO (U7.4)
A4: ET-POWER (P1.C14), ET-IO (U7.3)
A5: ET-POWER (P1.A14), ET-IO (U7.2)
A6: ET-POWER (P1.C15), ET-IO (U7.1)
A7: ET-POWER (P1.A15), ET-IO (U7.15)
A8: ET-POWER (P1.C16), ET-IO (U8.7)
A9: ET-POWER (P1.A16), ET-IO (U8.6)
A10: ET-POWER (P1.C17), ET-IO (U8.5)
A11: ET-POWER (P1.A17), ET-IO (U8.4)
A12: ET-POWER (P1.C18), ET-IO (U8.3)
A13: ET-POWER (P1.A18), ET-IO (U8.2)
A14: ET-POWER (P1.C19), ET-IO (U8.1)
A15: ET-POWER (P1.A19), ET-IO (U8.15)
ADC: ET-POWER (P1.A21 P1.B21 P1.C21), ET-AIO (R10.CW U11.2)
ADCLK: ET-IO (J1.23), ET-AIO (U14.7)
ADOTR: ET-IO (J2.17), ET-AIO (U14.25)
D0: ET-POWER (P1.C4), ET-IO (U4.7)
D1: ET-POWER (P1.A4), ET-IO (U4.6)
D2: ET-POWER (P1.C5), ET-IO (U4.5)
D3: ET-POWER (P1.A5), ET-IO (U4.4)
D4: ET-POWER (P1.C6), ET-IO (U4.3)
D5: ET-POWER (P1.A6), ET-IO (U4.2)
D6: ET-POWER (P1.C7), ET-IO (U4.1)
D7: ET-POWER (P1.A7), ET-IO (U4.15)
D8: ET-POWER (P1.C8), ET-IO (U5.7)
D9: ET-POWER (P1.A8), ET-IO (U5.6)
D10: ET-POWER (P1.C9), ET-IO (U5.5)
D11: ET-POWER (P1.A9), ET-IO (U5.4)
D12: ET-POWER (P1.C10), ET-IO (U5.3)
D13: ET-POWER (P1.A10), ET-IO (U5.2)
D14: ET-POWER (P1.C11), ET-IO (U5.1)
D15: ET-POWER (P1.A11), ET-IO (U5.15)
DACLK: ET-IO (J1.8), ET-DAC (U15.28)
DI0: ET-IO (J1.9), ET-AIO (U14.24)
DI1: ET-IO (J1.10), ET-AIO (U14.23)
DI2: ET-IO (J1.11), ET-AIO (U14.22)
DI3: ET-IO (J1.12), ET-AIO (U14.21)
DI4: ET-IO (J1.13), ET-AIO (U14.20)
DI5: ET-IO (J1.14), ET-AIO (U14.19)
DI6: ET-IO (J1.15), ET-AIO (U14.18)
DI7: ET-IO (J1.16), ET-AIO (U14.17)
DI8: ET-IO (J1.17), ET-AIO (U14.16)
DI9: ET-IO (J1.18), ET-AIO (U14.15)
DI10: ET-IO (J1.19), ET-AIO (U14.14)
DI11: ET-IO (J1.20), ET-AIO (U14.13)
DI12: ET-IO (J1.21), ET-AIO (U14.12)
DI13: ET-IO (J1.22), ET-AIO (U14.11)
DO0: ET-IO (J1.1), ET-DAC (U15.14)
DO1: ET-IO (J2.24), ET-DAC (U15.13)
DO2: ET-IO (J1.2), ET-DAC (U15.12)
DO3: ET-IO (J2.23), ET-DAC (U15.11)
DO4: ET-IO (J1.3), ET-DAC (U15.10)
DO5: ET-IO (J2.22), ET-DAC (U15.9)
DO6: ET-IO (J1.4), ET-DAC (U15.8)
DO7: ET-IO (J2.21), ET-DAC (U15.7)
DO8: ET-IO (J1.5), ET-DAC (U15.6)
DO9: ET-IO (J2.20), ET-DAC (U15.5)
DO10: ET-IO (J1.6), ET-DAC (U15.4)
DO11: ET-IO (J2.19), ET-DAC (U15.3)
DO12: ET-IO (J1.7), ET-DAC (U15.2)
DO13: ET-IO (J2.18), ET-DAC (U15.1)
PGA0B: ET-IO (U6.4), ET-AIO (U12.1)
PGA1B: ET-IO (U6.3), ET-AIO (U12.16)
SIG: ET-POWER (P1.A32 P1.B32 P1.C32), ET-DAC (P5.1 R37.2 U17.6)